# Altium schematic sheet [SCH]_OldSensor.SchDoc
size A
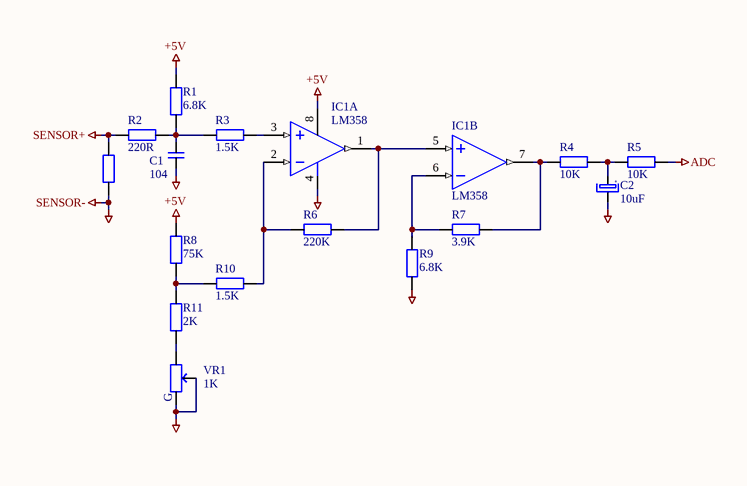
[diagram p0: [SCH]_OldSensor.SchDoc]

## Parts
C1  104  [Cap-Non-150mil]
C2  10uF  [Cap-P-1.5/4]
IC1  LM358  [DIP8]  (parts A,B of 2)
R1  6.8K  [Res1/4W]
R2  220R  [Res1/4W]
R3  1.5K  [Res1/4W]
R4  10K  [Res1/4W]
R5  10K  [Res1/4W]
R6  220K  [Res1/4W]
R7  3.9K  [Res1/4W]
R8  75K  [Res1/4W]
R9  6.8K  [Res1/4W]
R10  1.5K  [Res1/4W]
R11  2K  [Res1/4W]
SENSOR1  5R  [Res1/4W]  (value not drawn)
VR1  1K  [VR-S3]

## Nets
+5V: IC1.8(+V) R1.2 R8.2
ADC: R5.2
GND: C1.1 C2.2 IC1.4(-V) R9.1 SENSOR1.1 VR1.1 VR1.2  [also labelled SENSOR-]
SENSOR+: R2.1 SENSOR1.2
NetC1_2: C1.2 R1.1 R2.2 R3.1
NetC2_1: C2.1 R4.2 R5.1
NetIC1_1: IC1.1(OUT) IC1.5(IN+) R6.2
NetIC1_2: IC1.2(IN-) R6.1 R10.2
NetIC1_3: IC1.3(IN+) R3.2
NetIC1_6: IC1.6(IN-) R7.1 R9.2
NetIC1_7: IC1.7(OUT) R4.1 R7.2
NetR8_1: R8.1 R10.1 R11.2
NetR11_1: R11.1 VR1.3

## Notes on the sheet
- (in symbol Cap-Pol-Dip) +
- (in symbol Res-Var-Singal) G

## Library data of the parts
C1 = Cap-Non-Dip: Non-polar capacitor
C2 = Cap-Pol-Dip: Polarized capacitor
IC1 = LM358: Low-Power Dual Operational Amplifier; Value: LM358
R1-R11 SENSOR1 = Res 1/4W: Resistor 1/4W
VR1 = Res-Var-Singal: Variable Resistor